# EAGLE board TFG_board_01 (EAGLE 7.6.0), part 1 of 2
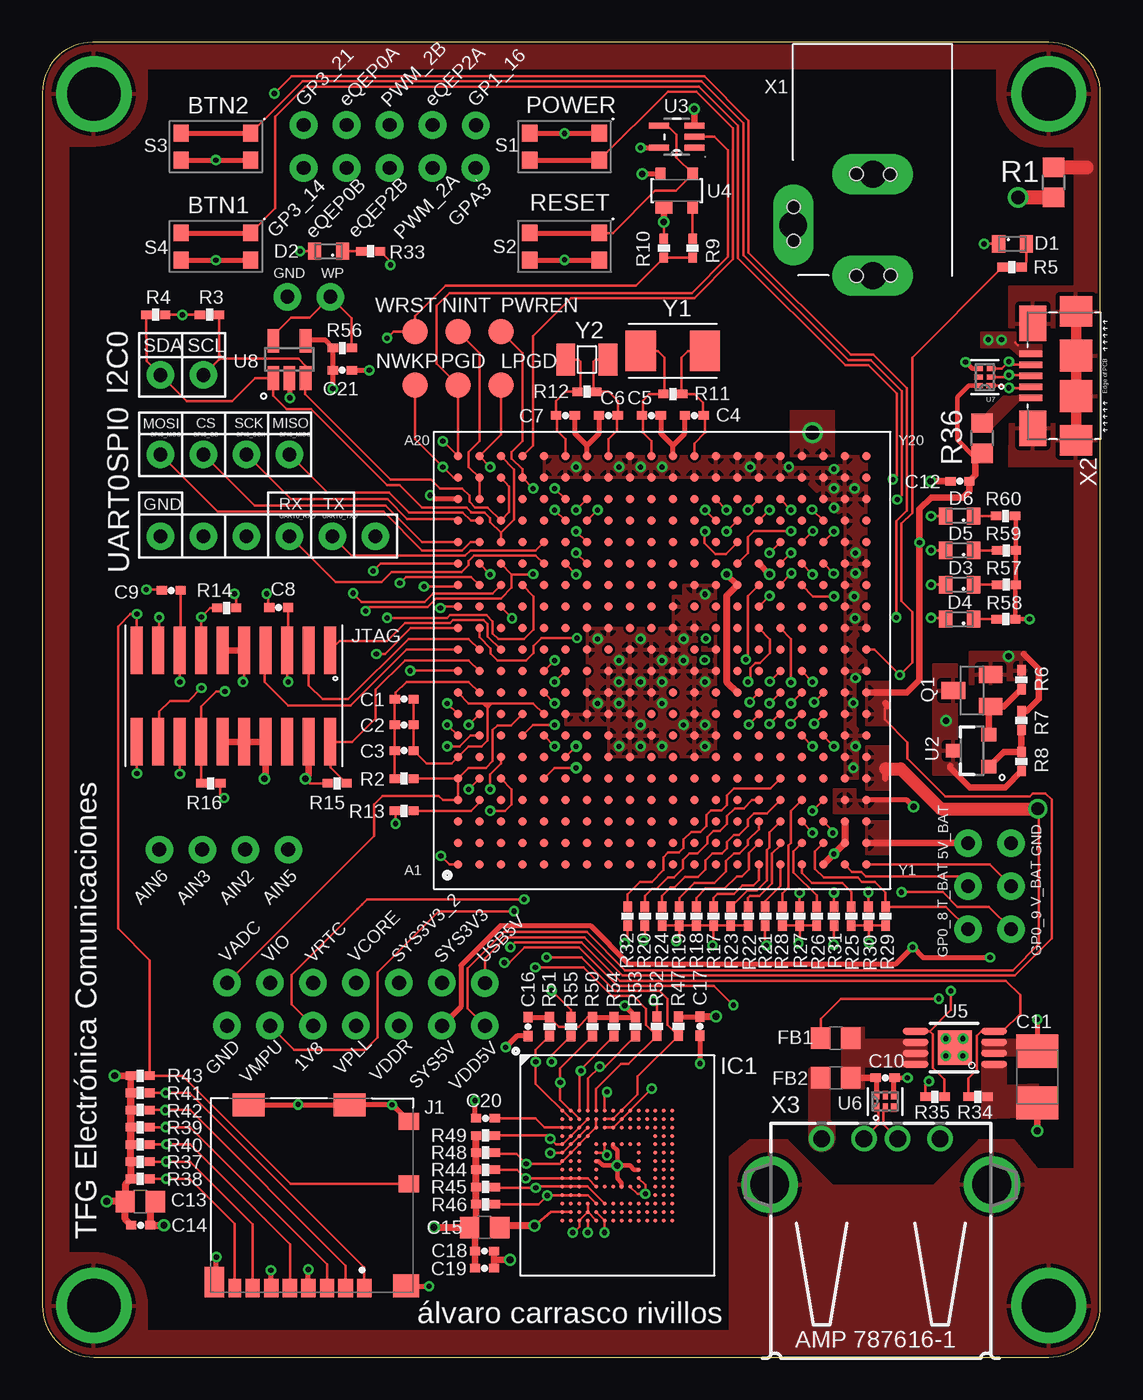
[diagram p8: board, top side]
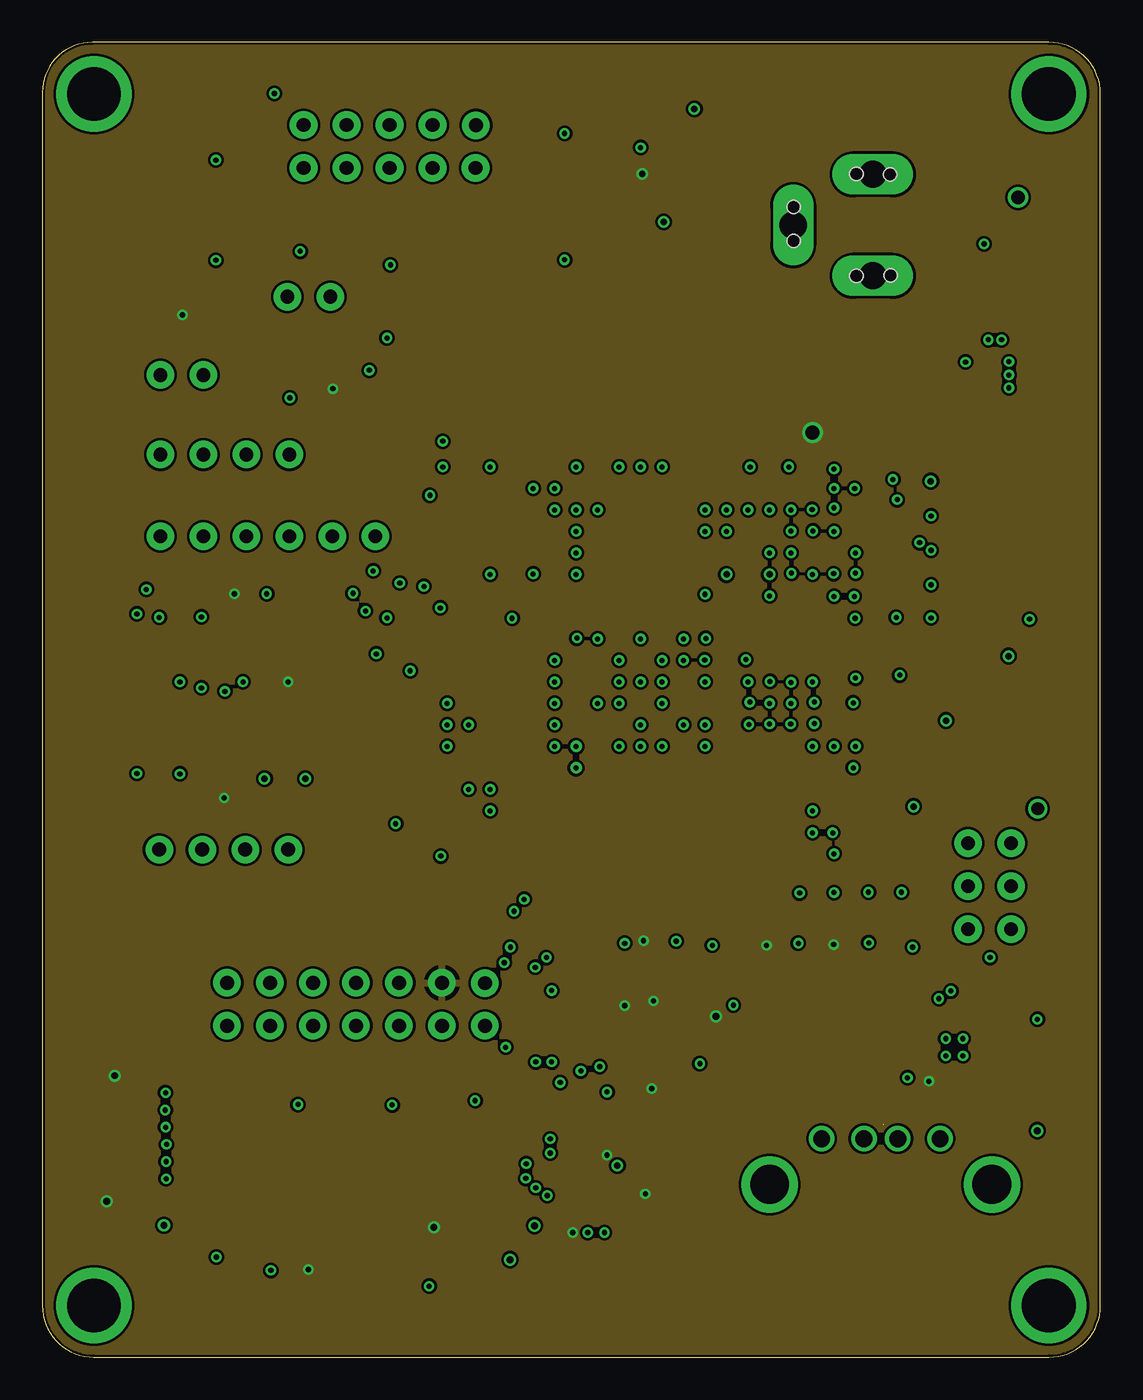
[diagram p9: board, inner layer Route2]
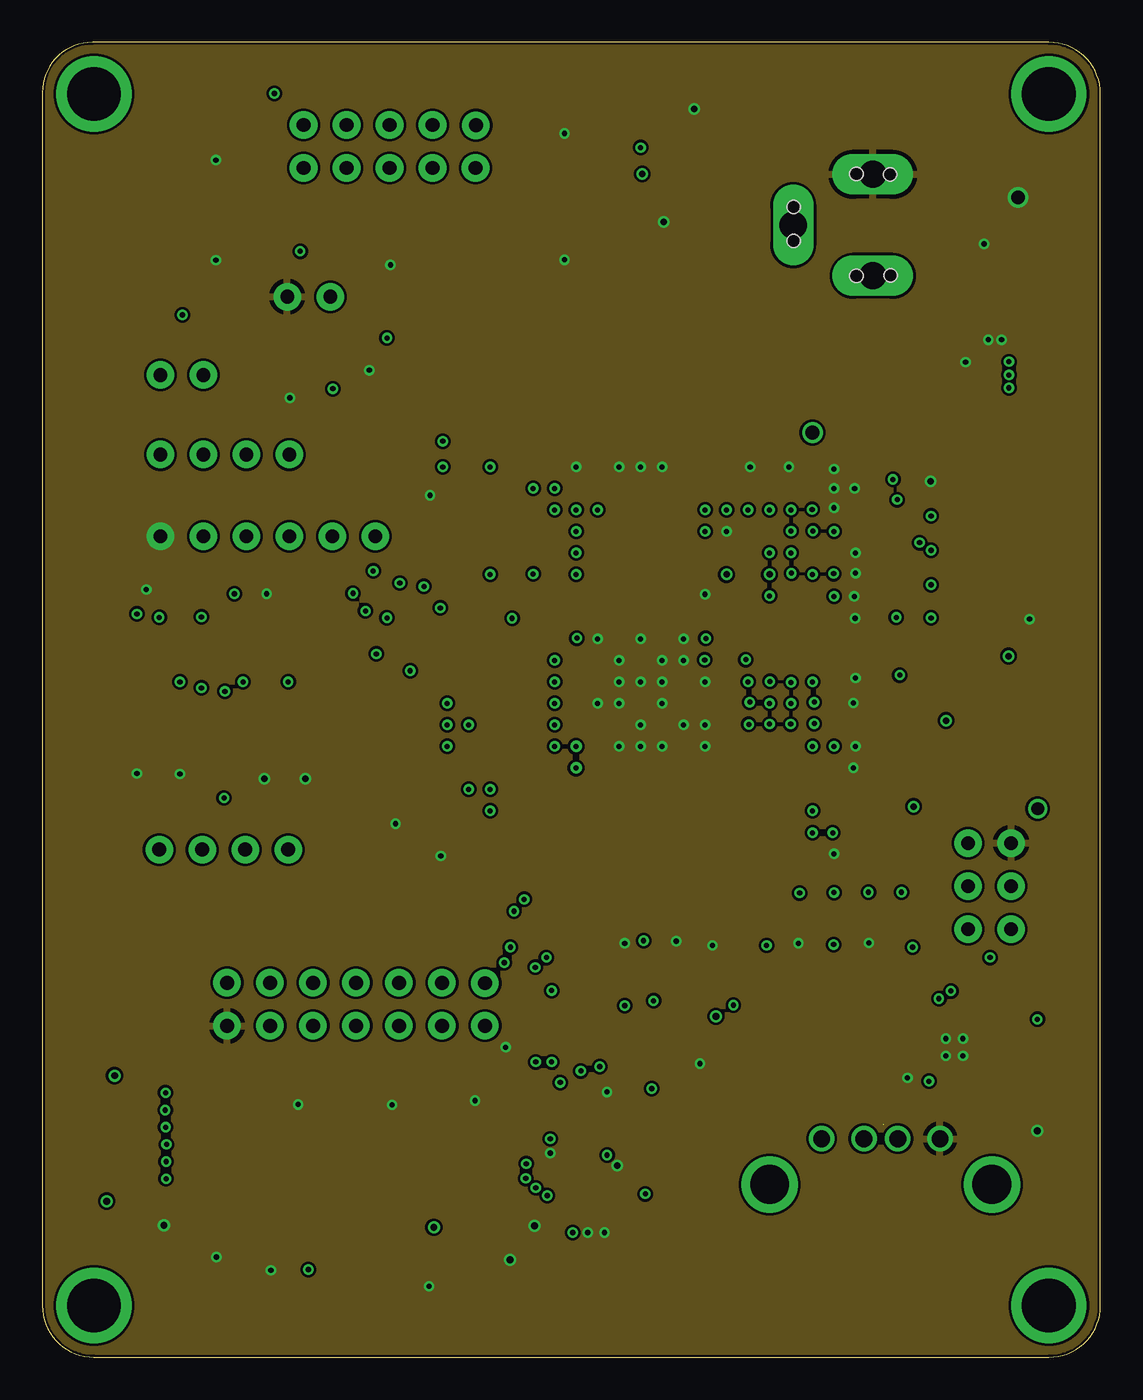
[diagram p10: board, inner layer Route15]
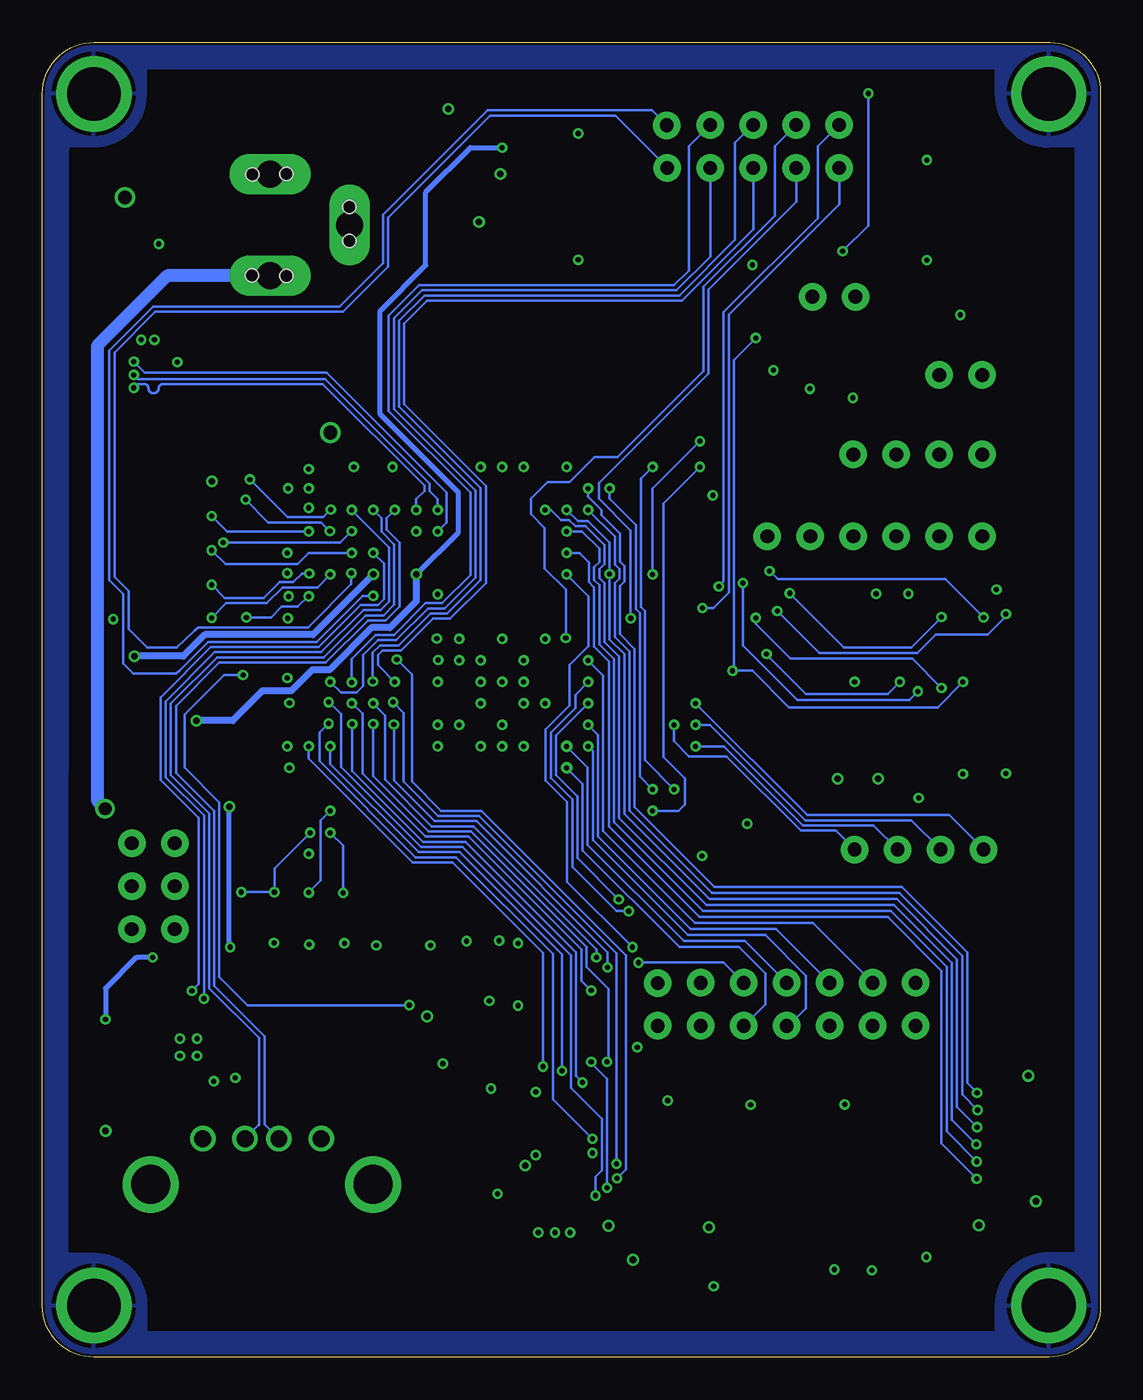
[diagram p11: board, bottom side, seen from below]

Size 62.53 x 77.7 mm. Coordinates in mm from the lower left corner, seen from the top.
Outline: 0,3.05 arc90 3.05,0 59.49,0 arc90 62.53,3.05 62.53,74.65 arc90 59.49,77.7 2.97,77.7 arc90 0,74.73 0,3.05
Copper layers ((1*2)*(15*16)): Top 0.035mm / dielectric 0.2mm / Route2 0.035mm / dielectric 0.2mm / Route15 0.035mm / dielectric 0.2mm / Bottom 0.035mm
Design rules "default *": minimum track width 6mil, minimum drill 12mil, track to track 6mil, track to pad 6mil, pad to pad 6mil, via to via 6mil, smd to smd 6mil, copper to edge 6mil, drill to drill 6mil, minimum pad ring 10mil, minimum via ring 6mil, stop-mask expansion 2mil, vias tented up to drill 0mil, thermal gap 10mil

## Footprints (pad centres in the part's own frame; a part is rotated, then mirrored left to right if it is on the bottom)
TESTPAD/W_HOLE_1X1 = drill 0.813 pad 1.626: P$1 0,0
HOLE = drill 0.813 pad 1.626: P$1 0,0
C0402 = smd 0.61 x 0.508: 1 -0.559,0; 2 0.559,0
B/3528-21R = smd 1.95 x 2.5: + 1.525,0; - -1.525,0
C0805 = smd 1.143 x 1.27: 1 -0.889,0; 2 0.889,0
EIA-STD = smd 0.787 x 1.016: 1 -0.826,0; 2 0.826,0
MICRON_EMMC_153 = smd 0.245 x 0.245: A1 -3.25,3.25; A2 -2.75,3.25; A3 -2.25,3.25; A4 -1.75,3.25; A5 -1.25,3.25; A6 -0.75,3.25; A7 -0.25,3.25; A8 0.25,3.25; A9 0.75,3.25; A10 1.25,3.25; A11 1.75,3.25; A12 2.25,3.25; A13 2.75,3.25; A14 3.25,3.25; B1 -3.25,2.75; B2 -2.75,2.75; B3 -2.25,2.75; B4 -1.75,2.75; B5 -1.25,2.75; B6 -0.75,2.75; B7 -0.25,2.75; B8 0.25,2.75; B9 0.75,2.75; B10 1.25,2.75; B11 1.75,2.75; B12 2.25,2.75; B13 2.75,2.75; B14 3.25,2.75; C1 -3.25,2.25; C2 -2.75,2.25; C3 -2.25,2.25; C4 -1.75,2.25; C5 -1.25,2.25; C6 -0.75,2.25; C7 -0.25,2.25; C8 0.25,2.25; C9 0.75,2.25; C10 1.25,2.25; C11 1.75,2.25; C12 2.25,2.25; C13 2.75,2.25; C14 3.25,2.25; D1 -3.25,1.75; D2 -2.75,1.75; D3 -2.25,1.75; D4 -1.75,1.75; D12 2.25,1.75; D13 2.75,1.75; D14 3.25,1.75; E1 -3.25,1.25; E2 -2.75,1.25; E3 -2.25,1.25; E5 -1.25,1.25; E6 -0.75,1.25; E7 -0.25,1.25; E8 0.25,1.25; E9 0.75,1.25; E10 1.25,1.25; E12 2.25,1.25; E13 2.75,1.25; E14 3.25,1.25; F1 -3.25,0.75; F2 -2.75,0.75; F3 -2.25,0.75; F5 -1.25,0.75; F10 1.25,0.75; F12 2.25,0.75; F13 2.75,0.75; F14 3.25,0.75; G1 -3.25,0.25; G2 -2.75,0.25; G3 -2.25,0.25; G5 -1.25,0.25; G10 1.25,0.25; G12 2.25,0.25; G13 2.75,0.25; G14 3.25,0.25; H1 -3.25,-0.25; H2 -2.75,-0.25; H3 -2.25,-0.25; H5 -1.25,-0.25; H10 1.25,-0.25; H12 2.25,-0.25; H13 2.75,-0.25; H14 3.25,-0.25; J1 -3.25,-0.75; J2 -2.75,-0.75; J3 -2.25,-0.75; J5 -1.25,-0.75; J10 1.25,-0.75; J12 2.25,-0.75; J13 2.75,-0.75; J14 3.25,-0.75; K1 -3.25,-1.25; K2 -2.75,-1.25; K3 -2.25,-1.25; K5 -1.25,-1.25; K6 -0.75,-1.25; K7 -0.25,-1.25; K8 0.25,-1.25; K9 0.75,-1.25; K10 1.25,-1.25; K12 2.25,-1.25; K13 2.75,-1.25; K14 3.25,-1.25; L1 -3.25,-1.75; L2 -2.75,-1.75; L3 -2.25,-1.75; L12 2.25,-1.75; L13 2.75,-1.75; L14 3.25,-1.75; M1 -3.25,-2.25; M2 -2.75,-2.25; M3 -2.25,-2.25; M4 -1.75,-2.25; M5 -1.25,-2.25; M6 -0.75,-2.25; M7 -0.25,-2.25; M8 0.25,-2.25; M9 0.75,-2.25; M10 1.25,-2.25; M11 1.75,-2.25; M12 2.25,-2.25; M13 2.75,-2.25; M14 3.25,-2.25; N1 -3.25,-2.75; N2 -2.75,-2.75; N3 -2.25,-2.75; N4 -1.75,-2.75; N5 -1.25,-2.75; N6 -0.75,-2.75; N7 -0.25,-2.75; N8 0.25,-2.75; N9 0.75,-2.75; N10 1.25,-2.75; N11 1.75,-2.75; N12 2.25,-2.75; N13 2.75,-2.75; N14 3.25,-2.75; P1 -3.25,-3.25; P2 -2.75,-3.25; P3 -2.25,-3.25; P4 -1.75,-3.25; P5 -1.25,-3.25; P6 -0.75,-3.25; P7 -0.25,-3.25; P8 0.25,-3.25; P9 0.75,-3.25; P10 1.25,-3.25; P11 1.75,-3.25; P12 2.25,-3.25; P13 2.75,-3.25; P14 3.25,-3.25
MOLEX_104031-0811 = smd 0.85 x 1.1: 1 3.105,-5.2; 3 0.905,-5.2; 4 -0.195,-5.2; 5 -1.295,-5.2; 6 -2.395,-5.2; 7 -3.495,-5.2 | smd 0.875 x 1.1: 2 2.005,-5.2 | smd 0.75 x 1.1: 8 -4.545,-5.2 | smd 1.2 x 1: 9 5.74,0.95; 10 5.74,4.65 | smd 1.55 x 1.35: G1 5.565,-5.075 | smd 1.17 x 1.8: G2 -5.755,-4.85 | smd 1.9 x 1.35: G3 -3.73,5.625; G4 2.24,5.625
CTI-JTAG = smd 2.794 x 0.711: 1 -2.705,5.715; 2 2.705,5.715; 3 -2.705,4.445; 4 2.705,4.445; 5 -2.705,3.175; 6 2.705,3.175; 7 -2.705,1.905; 8 2.705,1.905; 9 -2.705,0.635; 10 2.705,0.635; 11 -2.705,-0.635; 12 2.705,-0.635; 13 -2.705,-1.905; 14 2.705,-1.905; 15 -2.705,-3.175; 16 2.705,-3.175; 17 -2.705,-4.445; 18 2.705,-4.445; 19 -2.705,-5.715; 20 2.705,-5.715
TP15R = smd 1.5 x 1.5: TP 0,0
MOUNTING_HOLE = drill 3.175 pad 4.445: P$1 0,0
SOT23-BEC = smd 1 x 1.4: B -0.95,-1.1; C 0,1.1; E 0.95,-1.1
R0805 = smd 1.143 x 1.27: 1 -0.889,0; 2 0.889,0
R0402 = smd 0.61 x 0.508: 1 -0.559,0; 2 0.559,0
SW4SMD_63X161LS = smd 0.9 x 1: 1 2.05,0.8; 2 2.05,-0.8; 3 -2.05,0.8; 4 -2.05,-0.8
OSD335X-BGA-400 = smd 0.5 x 0.5: A1 -12.065,-12.065; A2 -12.065,-10.795; A3 -12.065,-9.525; A4 -12.065,-8.255; A5 -12.065,-6.985; A6 -12.065,-5.715; A7 -12.065,-4.445; A8 -12.065,-3.175; A9 -12.065,-1.905; A10 -12.065,-0.635; A11 -12.065,0.635; A12 -12.065,1.905; A13 -12.065,3.175; A14 -12.065,4.445; A15 -12.065,5.715; A16 -12.065,6.985; A17 -12.065,8.255; A18 -12.065,9.525; A19 -12.065,10.795; A20 -12.065,12.065; B1 -10.795,-12.065; B2 -10.795,-10.795; B3 -10.795,-9.525; B4 -10.795,-8.255; B5 -10.795,-6.985; B6 -10.795,-5.715; B7 -10.795,-4.445; B8 -10.795,-3.175; B9 -10.795,-1.905; B10 -10.795,-0.635; B11 -10.795,0.635; B12 -10.795,1.905; B13 -10.795,3.175; B14 -10.795,4.445; B15 -10.795,5.715; B16 -10.795,6.985; B17 -10.795,8.255; B18 -10.795,9.525; B19 -10.795,10.795; B20 -10.795,12.065; C1 -9.525,-12.065; C2 -9.525,-10.795; C3 -9.525,-9.525; C4 -9.525,-8.255; C5 -9.525,-6.985; C6 -9.525,-5.715; C7 -9.525,-4.445; C8 -9.525,-3.175; C9 -9.525,-1.905; C10 -9.525,-0.635; C11 -9.525,0.635; C12 -9.525,1.905; C13 -9.525,3.175; C14 -9.525,4.445; C15 -9.525,5.715; C16 -9.525,6.985; C17 -9.525,8.255; C18 -9.525,9.525; C19 -9.525,10.795; C20 -9.525,12.065; D1 -8.255,-12.065; D2 -8.255,-10.795; D3 -8.255,-9.525; D4 -8.255,-8.255; D5 -8.255,-6.985; D6 -8.255,-5.715; D7 -8.255,-4.445; D8 -8.255,-3.175; D9 -8.255,-1.905; D10 -8.255,-0.635; D11 -8.255,0.635; D12 -8.255,1.905; D13 -8.255,3.175; D14 -8.255,4.445; D15 -8.255,5.715; D16 -8.255,6.985; D17 -8.255,8.255; D18 -8.255,9.525; D19 -8.255,10.795; D20 -8.255,12.065; E1 -6.985,-12.065; E2 -6.985,-10.795; E3 -6.985,-9.525; E4 -6.985,-8.255; E5 -6.985,-6.985; E6 -6.985,-5.715; E7 -6.985,-4.445; E8 -6.985,-3.175; E9 -6.985,-1.905; E10 -6.985,-0.635; E11 -6.985,0.635; E12 -6.985,1.905; E13 -6.985,3.175; E14 -6.985,4.445; E15 -6.985,5.715; E16 -6.985,6.985; E17 -6.985,8.255; E18 -6.985,9.525; E19 -6.985,10.795; E20 -6.985,12.065; F1 -5.715,-12.065; F2 -5.715,-10.795; F3 -5.715,-9.525; F4 -5.715,-8.255; F5 -5.715,-6.985; F6 -5.715,-5.715; F7 -5.715,-4.445; F8 -5.715,-3.175; F9 -5.715,-1.905; F10 -5.715,-0.635; F11 -5.715,0.635; F12 -5.715,1.905; F13 -5.715,3.175; F14 -5.715,4.445; F15 -5.715,5.715; F16 -5.715,6.985; F17 -5.715,8.255; F18 -5.715,9.525; F19 -5.715,10.795; F20 -5.715,12.065; G1 -4.445,-12.065; G2 -4.445,-10.795; G3 -4.445,-9.525; G4 -4.445,-8.255; G5 -4.445,-6.985; G6 -4.445,-5.715; G7 -4.445,-4.445; G8 -4.445,-3.175; G9 -4.445,-1.905; G10 -4.445,-0.635; G11 -4.445,0.635; G12 -4.445,1.905; G13 -4.445,3.175; G14 -4.445,4.445; G15 -4.445,5.715; G16 -4.445,6.985; G17 -4.445,8.255; G18 -4.445,9.525; G19 -4.445,10.795; G20 -4.445,12.065; H1 -3.175,-12.065; H2 -3.175,-10.795; H3 -3.175,-9.525; H4 -3.175,-8.255; H5 -3.175,-6.985; H6 -3.175,-5.715; H7 -3.175,-4.445; H8 -3.175,-3.175; H9 -3.175,-1.905; H10 -3.175,-0.635; H11 -3.175,0.635; H12 -3.175,1.905; H13 -3.175,3.175; H14 -3.175,4.445; H15 -3.175,5.715; H16 -3.175,6.985; H17 -3.175,8.255; H18 -3.175,9.525; H19 -3.175,10.795; H20 -3.175,12.065; J1 -1.905,-12.065; J2 -1.905,-10.795; J3 -1.905,-9.525; J4 -1.905,-8.255; J5 -1.905,-6.985; J6 -1.905,-5.715; J7 -1.905,-4.445; J8 -1.905,-3.175; J9 -1.905,-1.905; J10 -1.905,-0.635; J11 -1.905,0.635; J12 -1.905,1.905; J13 -1.905,3.175; J14 -1.905,4.445; J15 -1.905,5.715; J16 -1.905,6.985; J17 -1.905,8.255; J18 -1.905,9.525; J19 -1.905,10.795; J20 -1.905,12.065; K1 -0.635,-12.065; K2 -0.635,-10.795; K3 -0.635,-9.525; K4 -0.635,-8.255; K5 -0.635,-6.985; K6 -0.635,-5.715; K7 -0.635,-4.445; K8 -0.635,-3.175; K9 -0.635,-1.905; K10 -0.635,-0.635; K11 -0.635,0.635; K12 -0.635,1.905; K13 -0.635,3.175; K14 -0.635,4.445; K15 -0.635,5.715; K16 -0.635,6.985; K17 -0.635,8.255; K18 -0.635,9.525; K19 -0.635,10.795; K20 -0.635,12.065; L1 0.635,-12.065; L2 0.635,-10.795; L3 0.635,-9.525; L4 0.635,-8.255; L5 0.635,-6.985; L6 0.635,-5.715; L7 0.635,-4.445; L8 0.635,-3.175; L9 0.635,-1.905; L10 0.635,-0.635; L11 0.635,0.635; L12 0.635,1.905; L13 0.635,3.175; L14 0.635,4.445; L15 0.635,5.715; L16 0.635,6.985; L17 0.635,8.255; L18 0.635,9.525; L19 0.635,10.795; L20 0.635,12.065; M1 1.905,-12.065; M2 1.905,-10.795; M3 1.905,-9.525; M4 1.905,-8.255; M5 1.905,-6.985; M6 1.905,-5.715; M7 1.905,-4.445; M8 1.905,-3.175; M9 1.905,-1.905; M10 1.905,-0.635; M11 1.905,0.635; M12 1.905,1.905; M13 1.905,3.175; M14 1.905,4.445; M15 1.905,5.715; M16 1.905,6.985; M17 1.905,8.255; M18 1.905,9.525; M19 1.905,10.795; M20 1.905,12.065; N1 3.175,-12.065; N2 3.175,-10.795; N3 3.175,-9.525; N4 3.175,-8.255; N5 3.175,-6.985; N6 3.175,-5.715; N7 3.175,-4.445; N8 3.175,-3.175; N9 3.175,-1.905; N10 3.175,-0.635; N11 3.175,0.635; N12 3.175,1.905; N13 3.175,3.175; N14 3.175,4.445; N15 3.175,5.715; N16 3.175,6.985; N17 3.175,8.255; N18 3.175,9.525; N19 3.175,10.795; N20 3.175,12.065; P1 4.445,-12.065; P2 4.445,-10.795; P3 4.445,-9.525; P4 4.445,-8.255; P5 4.445,-6.985; P6 4.445,-5.715; P7 4.445,-4.445; P8 4.445,-3.175; P9 4.445,-1.905; P10 4.445,-0.635; P11 4.445,0.635; P12 4.445,1.905; P13 4.445,3.175; P14 4.445,4.445; P15 4.445,5.715; P16 4.445,6.985; P17 4.445,8.255; P18 4.445,9.525; P19 4.445,10.795; P20 4.445,12.065; R1 5.715,-12.065; R2 5.715,-10.795; R3 5.715,-9.525; R4 5.715,-8.255; R5 5.715,-6.985; R6 5.715,-5.715; R7 5.715,-4.445; R8 5.715,-3.175; R9 5.715,-1.905; R10 5.715,-0.635; R11 5.715,0.635; R12 5.715,1.905; R13 5.715,3.175; R14 5.715,4.445; R15 5.715,5.715; R16 5.715,6.985; R17 5.715,8.255; R18 5.715,9.525; R19 5.715,10.795; R20 5.715,12.065; T1 6.985,-12.065; T2 6.985,-10.795; T3 6.985,-9.525; T4 6.985,-8.255; T5 6.985,-6.985; T6 6.985,-5.715; T7 6.985,-4.445; T8 6.985,-3.175; T9 6.985,-1.905; T10 6.985,-0.635; T11 6.985,0.635; T12 6.985,1.905; T13 6.985,3.175; T14 6.985,4.445; T15 6.985,5.715; T16 6.985,6.985; T17 6.985,8.255; T18 6.985,9.525; T19 6.985,10.795; T20 6.985,12.065; U1 8.255,-12.065; U2 8.255,-10.795; U3 8.255,-9.525; U4 8.255,-8.255; U5 8.255,-6.985; U6 8.255,-5.715; U7 8.255,-4.445; U8 8.255,-3.175; U9 8.255,-1.905; U10 8.255,-0.635; U11 8.255,0.635; U12 8.255,1.905; U13 8.255,3.175; U14 8.255,4.445; U15 8.255,5.715; U16 8.255,6.985; U17 8.255,8.255; U18 8.255,9.525; U19 8.255,10.795; U20 8.255,12.065; V1 9.525,-12.065; V2 9.525,-10.795; V3 9.525,-9.525; V4 9.525,-8.255; V5 9.525,-6.985; V6 9.525,-5.715; V7 9.525,-4.445; V8 9.525,-3.175; V9 9.525,-1.905; V10 9.525,-0.635; V11 9.525,0.635; V12 9.525,1.905; V13 9.525,3.175; V14 9.525,4.445; V15 9.525,5.715; V16 9.525,6.985; V17 9.525,8.255; V18 9.525,9.525; V19 9.525,10.795; V20 9.525,12.065; W1 10.795,-12.065; W2 10.795,-10.795; W3 10.795,-9.525; W4 10.795,-8.255; W5 10.795,-6.985; W6 10.795,-5.715; W7 10.795,-4.445; W8 10.795,-3.175; W9 10.795,-1.905; W10 10.795,-0.635; W11 10.795,0.635; W12 10.795,1.905; W13 10.795,3.175; W14 10.795,4.445; W15 10.795,5.715; W16 10.795,6.985; W17 10.795,8.255; W18 10.795,9.525; W19 10.795,10.795; W20 10.795,12.065; Y1 12.065,-12.065; Y2 12.065,-10.795; Y3 12.065,-9.525; Y4 12.065,-8.255; Y5 12.065,-6.985; Y6 12.065,-5.715; Y7 12.065,-4.445; Y8 12.065,-3.175; Y9 12.065,-1.905; Y10 12.065,-0.635; Y11 12.065,0.635; Y12 12.065,1.905; Y13 12.065,3.175; Y14 12.065,4.445; Y15 12.065,5.715; Y16 12.065,6.985; Y17 12.065,8.255; Y18 12.065,9.525; Y19 12.065,10.795; Y20 12.065,12.065
SOT23-3 = smd 0.8 x 0.9: 1 -0.95,-1; 2 0.95,-1; 3 0,1.1
DCK5 = smd 1.168 x 0.356: 1 -1.041,0.65; 2 -1.041,0; 3 -1.041,-0.65; 4 1.041,-0.65; 5 1.041,0.65
SOT143-R = smd 1 x 0.7: 1 -0.75,-1 | smd 0.6 x 0.7: 2 0.95,-1; 3 0.95,1; 4 -0.95,1
S-PDSO-G08 = smd 1.524 x 0.406: 1 -2.311,0.975; 2 -2.324,0.325; 3 -2.324,-0.325; 4 -2.324,-0.975; 5 2.324,-0.975; 6 2.324,-0.325; 7 2.324,0.325; 8 2.311,0.975 | smd 2.032 x 2.032: TH 0,0
DRY6 = smd 0.55 x 0.3: 1 -0.355,0.5 | smd 0.52 x 0.3: 2 -0.37,0; 3 -0.37,-0.5; 4 0.37,-0.5; 5 0.37,0; 6 0.37,0.5
SOT23-5 = smd 0.7 x 1.4: 1 0.95,1.1; 2 0,1.1; 3 -0.95,1.1; 4 -0.95,-1.1; 5 0.95,-1.1
PJ-102B_POWER_CON = drill 1.6 long: IN -6,0; OUT 0,0; OUT_CON -3,4.7 | hole 0.762: 0,-1.041; 0.025,0.965; -5.994,0.965; -5.969,-1.067; -1.93,4.674; -3.937,4.674
10118192-0001LF(MICRO-USB-B-AMPHENOL-FCI) = smd 1.8 x 1.9: CGND1 -3.8,0; CGND4 3.8,0 | smd 1.9 x 1.9: CGND2 -1.2,0; CGND3 1.2,0 | smd 2.1 x 1.6: CGND5 3.1,2.55; CGND6 -3.1,2.55 | smd 0.4 x 1.35: D+ 0,2.675; D- -0.65,2.675; GND 1.3,2.675; ID 0.65,2.675; VBUS -1.3,2.675
USB_HOST_HORIZONTAL_W/CHASSIS_GND = drill 1: 1 -3.5,12.99; 2 -1,12.99; 3 1,12.99; 4 3.5,12.99 | drill 2.3: 5 -6.57,10.28; 6 6.57,10.28
CRYSTAL-TXC-7A = smd 1.788 x 2.413: P$1 1.9,0; P$2 -1.9,0
CRYSTAL_3.2X1.5 = smd 1.1 x 1.9: P$1 -1.25,0; P$2 1.25,0

## Placement (x,y rotation side)
5V_BAT  TESTPAD/W_HOLE_1X1  [TESTPAD/W_HOLE_1X1]  54.71,30.38 270 top
AIN2  HOLE  [HOLE]  11.99,30 0 top
AIN3  HOLE  [HOLE]  9.45,30 0 top
AIN5  HOLE  [HOLE]  14.53,30 0 top
AIN6  HOLE  [HOLE]  6.91,30 0 top
C1  0.1uF, 6.3V  [C0402]  21.39,38.89 180 top
C2  0.1uF, 6.3V  [C0402]  21.39,37.36 180 top
C3  1nF, 50V  [C0402]  21.39,35.84 180 top
C4  18pF 50V  [C0402]  38.53,55.65 0 top
C5  18pF 50V  [C0402]  35.99,55.65 180 top
C6  18pF 50V  [C0402]  33.45,55.65 0 top
C7  18pF 50V  [C0402]  30.91,55.65 180 top
C8  0.1uF 6.3V  [C0402]  13.97,44.3 0 top
C9  0.1uF 6.3V  [C0402]  7.62,45.31 0 top
C10  0.1uF 6.3V  [C0402]  49.81,16.51 0 top
C11  220uF 6.3V  [B/3528-21R]  58.8,16.56 90 top
C12  0.1uF 6.3V  [C0402]  54.23,51.77 180 top
C13  10uF, 10V  [C0805]  5.79,9.19 0 top
C14  0.1uF, 6.3V  [C0402]  5.82,7.8 0 top
C15  10uF, 10V  [C0805]  26.14,7.67 0 top
C16  0.1uF, 6.3V  [C0402]  28.7,19.53 270 top
C17  0.1uF, 6.3V  [C0402]  38.86,19.56 270 top
C18  0.1uF, 6.3V  [C0402]  26.14,6.27 0 top
C19  0.1uF, 6.3V  [C0402]  26.14,5.26 0 top
C20  2.2uF  [C0402]  26.19,14.12 180 top
C21  0.1uF  [C0402]  17.73,58.32 0 top
D1  LTST-C191TBKT  [EIA-STD]  57.33,65.79 180 top
D2  LTST-C191TBKT  [EIA-STD]  16.92,65.35 0 top
D3  LTST-C191TBKT  [EIA-STD]  54.2,45.64 0 top
D4  LTST-C191TBKT  [EIA-STD]  54.2,43.61 0 top
D5  LTST-C191TBKT  [EIA-STD]  54.2,47.68 0 top
D6  LTST-C191TBKT  [EIA-STD]  54.2,49.71 0 top
FB1  0.1Ohm  [C0805]  46.89,18.85 0 top
FB2  150Ohm, 800mA  [C0805]  46.89,16.51 180 top
GND  TESTPAD/W_HOLE_1X1  [TESTPAD/W_HOLE_1X1]  57.25,30.38 270 top
GND3  TESTPAD/W_HOLE_1X1  [TESTPAD/W_HOLE_1X1]  10.92,19.58 0 top
GND.  TESTPAD/W_HOLE_1X1  [TESTPAD/W_HOLE_1X1]  14.48,62.66 0 top
IC1  [MICRON_EMMC_153]  33.99,11.33 0 top
J1  104031-0811  [MOLEX_104031-0811]  15.93,9.3 0 top
JTAG  [CTI-JTAG]  11.3,39.07 270 top
LPGD  TPTP15R  [TP15R]  27.1,57.43 0 top
MGT1  MOUNTING_HOLE  [MOUNTING_HOLE]  3.05,3.05 0 top
MGT2  MOUNTING_HOLE  [MOUNTING_HOLE]  59.49,3.05 0 top
MGT3  MOUNTING_HOLE  [MOUNTING_HOLE]  59.49,74.65 0 top
MGT4  MOUNTING_HOLE  [MOUNTING_HOLE]  3.05,74.65 0 top
NINT  TPTP15R  [TP15R]  24.56,60.6 0 top
NWKP  TPTP15R  [TP15R]  22.02,57.43 0 top
PGD  TPTP15R  [TP15R]  24.56,57.43 0 top
PWREN  TPTP15R  [TP15R]  27.1,60.6 0 top
Q1  MMBT2907SMD  [SOT23-BEC]  54.94,39.4 90 top
R1  0.1R  [R0805]  59.77,69.42 90 top
R2  0R  [R0402]  21.39,34.19 180 top
R3  1K5 1%  [R0402]  9.88,61.59 180 top
R4  1K5 1%  [R0402]  6.71,61.59 0 top
R5  1K 1%  [R0402]  57.3,64.41 180 top
R6  499R 1%  [R0402]  57.86,40.03 90 top
R7  10K 1%  [R0402]  57.86,37.62 90 top
R8  40.2K 1%  [R0402]  57.86,35.2 90 top
R9  1K  [R0402]  38.43,65.53 270 top
R10  100K  [R0402]  36.73,65.53 270 top
R11  1M  [R0402]  37.26,56.92 0 top
R12  [R0402]  32.18,57.05 0 top
R13  10K  [R0402]  21.39,32.28 180 top
R14  4K75  [R0402]  10.9,44.27 0 top
R15  4K75  [R0402]  17.42,33.91 0 top
R16  4K75  [R0402]  9.96,33.91 0 top
R17  100K  [R0402]  39.67,26.06 90 top
R18  100K  [R0402]  38.66,26.06 90 top
R19  100K  [R0402]  37.64,26.06 90 top
R20  100K  [R0402]  35.61,26.06 270 top
R21  100K  [R0402]  42.72,26.06 270 top
R22  100K  [R0402]  41.71,26.06 90 top
R23  100K  [R0402]  40.69,26.06 90 top
R24  100K  [R0402]  36.63,26.06 90 top
R25  100K  [R0402]  47.8,26.06 90 top
R26  100K  [R0402]  45.77,26.06 90 top
R27  100K  [R0402]  44.75,26.06 90 top
R28  100K  [R0402]  43.74,26.06 90 top
R29  100K  [R0402]  49.83,26.06 90 top
R30  100K  [R0402]  48.82,26.06 90 top
R31  100K  [R0402]  46.79,26.06 270 top
R32  100K  [R0402]  34.59,26.06 90 top
R33  1K5  [R0402]  19.41,65.35 180 top
R34  10K  [R0402]  55.3,15.39 180 top
R35  10K  [R0402]  52.76,15.39 180 top
R36  0 Ohm  [R0805]  55.55,54.31 90 top
R37  10K  [R0402]  5.79,11.56 180 top
R38  10K  [R0402]  5.79,10.54 180 top
R39  10K  [R0402]  5.79,13.59 180 top
R40  10K  [R0402]  5.79,12.57 180 top
R41  10K  [R0402]  5.79,15.62 180 top
R42  10K  [R0402]  5.79,14.61 180 top
R43  10K  [R0402]  5.79,16.64 180 top
R44  10K  [R0402]  26.19,11.07 180 top
R45  10K  [R0402]  26.19,10.06 180 top
R46  10K  [R0402]  26.19,9.04 180 top
R47  10K  [R0402]  37.59,19.56 90 top
R48  10K  [R0402]  26.19,12.09 180 top
R49  10K  [R0402]  26.19,13.11 180 top
R50  10K  [R0402]  32.51,19.53 90 top
R51  10K  [R0402]  29.97,19.53 90 top
R52  10K  [R0402]  36.32,19.56 90 top
R53  10K  [R0402]  35.05,19.53 90 top
R54  10K  [R0402]  33.78,19.53 90 top
R55  33, 5%  [R0402]  31.24,19.53 270 top
R56  10K  [R0402]  17.73,59.64 180 top
R57  1K5  [R0402]  56.97,45.64 180 top
R58  1K5  [R0402]  56.95,43.61 180 top
R59  1K5  [R0402]  56.97,47.68 180 top
R60  1K5  [R0402]  56.92,49.71 180 top
S1  KMR231GLFS  [SW4SMD_63X161LS]  30.86,71.53 0 top
S2  KMR231GLFS  [SW4SMD_63X161LS]  30.86,65.63 0 top
S3  KMR231GLFS  [SW4SMD_63X161LS]  10.26,71.53 0 top
S4  KMR231GLFS  [SW4SMD_63X161LS]  10.26,65.63 0 top
SCL  HOLE  [HOLE]  9.53,58.04 0 top
SDA  HOLE  [HOLE]  6.99,58.04 0 top
SPI0_CS  HOLE  [HOLE]  9.53,53.34 0 top
SPI0_MISO  HOLE  [HOLE]  14.61,53.34 0 top
SPI0_MOSI  HOLE  [HOLE]  6.99,53.34 0 top
SPI0_SCK  HOLE  [HOLE]  12.06,53.34 0 top
SYS_RTC_1P8V  TESTPAD/W_HOLE_1X1  [TESTPAD/W_HOLE_1X1]  16,22.12 180 top
SYS_VDD1_3P3V  TESTPAD/W_HOLE_1X1  [TESTPAD/W_HOLE_1X1]  23.62,22.12 180 top
SYS_VDD2_3P3V  TESTPAD/W_HOLE_1X1  [TESTPAD/W_HOLE_1X1]  21.08,22.12 180 top
SYS_VDD_1P8V  TESTPAD/W_HOLE_1X1  [TESTPAD/W_HOLE_1X1]  16,19.58 180 top
SYS_VOUT  TESTPAD/W_HOLE_1X1  [TESTPAD/W_HOLE_1X1]  23.62,19.58 180 top
T_BAT  TESTPAD/W_HOLE_1X1  [TESTPAD/W_HOLE_1X1]  54.71,27.84 270 top
U1  [OSD335X-BGA-400]  36.63,41.17 0 top
U2  TLVH431  [SOT23-3]  54.94,35.84 90 top
U3  SN74LVC1G07_DCK_5  [DCK5]  37.49,72.11 180 top
U4  APX811SOT  [SOT143-R]  37.49,68.94 0 top
U5  TPS2051  [S-PDSO-G08]  53.92,18.29 180 top
U6  TPD4S012_DRY_6  [DRY6]  49.81,15.11 90 top
U7  TPD4S012_DRY_6  [DRY6]  55.7,57.91 180 top
U8  24LC32A  [SOT23-5]  14.61,58.95 180 top
U$1  HOLE  [HOLE]  25.63,72.8 0 top
U$2  HOLE  [HOLE]  54.71,25.3 0 top
U$3  HOLE  [HOLE]  57.25,25.3 0 top
U$4  HOLE  [HOLE]  23.06,72.82 0 top
U$5  HOLE  [HOLE]  20.52,70.28 0 top
U$6  HOLE  [HOLE]  25.6,70.28 0 top
U$7  HOLE  [HOLE]  17.98,70.28 0 top
U$8  HOLE  [HOLE]  17.98,72.82 0 top
U$10  HOLE  [HOLE]  15.44,70.28 0 top
U$11  HOLE  [HOLE]  15.44,72.82 0 top
U$12  HOLE  [HOLE]  23.06,70.28 0 top
U$13  HOLE  [HOLE]  20.52,72.82 0 top
UART0_RXD  HOLE  [HOLE]  14.61,48.51 0 top
UART0_TXD  HOLE  [HOLE]  17.14,48.51 0 top
USB_DC  TESTPAD/W_HOLE_1X1  [TESTPAD/W_HOLE_1X1]  26.16,22.1 180 top
V_BAT  TESTPAD/W_HOLE_1X1  [TESTPAD/W_HOLE_1X1]  57.25,27.84 270 top
VDD_5V  TESTPAD/W_HOLE_1X1  [TESTPAD/W_HOLE_1X1]  26.16,19.58 180 top
VDD_ADC  TESTPAD/W_HOLE_1X1  [TESTPAD/W_HOLE_1X1]  10.92,22.12 0 top
VDD_CORE  TESTPAD/W_HOLE_1X1  [TESTPAD/W_HOLE_1X1]  18.54,22.12 180 top
VDD_MPU  TESTPAD/W_HOLE_1X1  [TESTPAD/W_HOLE_1X1]  13.46,19.58 180 top
VDDS_DDR  TESTPAD/W_HOLE_1X1  [TESTPAD/W_HOLE_1X1]  21.08,19.58 180 top
VDDS_PLL  TESTPAD/W_HOLE_1X1  [TESTPAD/W_HOLE_1X1]  18.54,19.58 180 top
VDDSHV_3P3V  TESTPAD/W_HOLE_1X1  [TESTPAD/W_HOLE_1X1]  13.46,22.12 180 top
WP  TESTPAD/W_HOLE_1X1  [TESTPAD/W_HOLE_1X1]  17.02,62.66 0 top
WRST  TPTP15R  [TP15R]  22.02,60.6 0 top
X1  [PJ-102B_POWER_CON]  49.07,69.9 90 top
X2  [10118192-0001LF(MICRO-USB-B-AMPHENOL-FCI)]  61.09,57.99 90 top
X3  [USB_HOST_HORIZONTAL_W/CHASSIS_GND]  49.56,-0.08 0 top
Y1  [CRYSTAL-TXC-7A]  37.26,59.46 0 top
Y2  ABS07-32.768KHZ-T  [CRYSTAL_3.2X1.5]  32.18,58.95 0 top